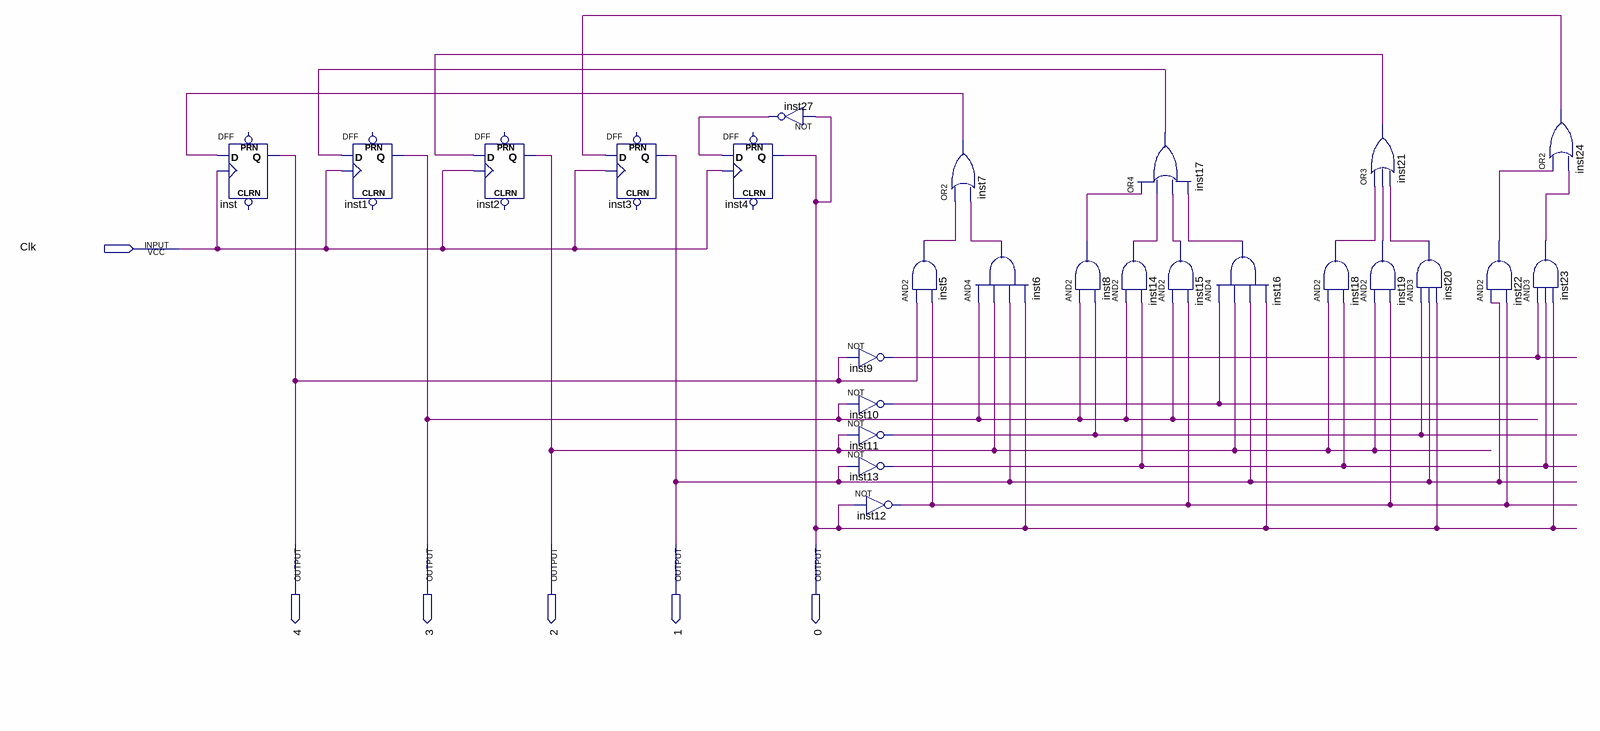
[diagram p0: schematic sheet]
// Quartus schematic Contador17.bdf as structural Verilog: 26 symbols, 6 pins
module Contador17 (
  input  Clk,
  output \4 ,
  output \3 ,
  output \2 ,
  output \1 ,
  output \0 
);

  wire inst5_out, inst6_out, inst7_out, inst8_out, inst9_out, inst10_out, inst11_out, inst12_out, inst13_out,
       inst14_out, inst15_out, inst16_out, inst17_out, inst18_out, inst19_out, inst20_out, inst21_out,
       inst22_out, inst23_out, inst24_out, inst27_out;

  DFF inst (.CLK(Clk), .D(inst7_out), .Q(\4 ));  // open: CLRN, PRN
  DFF inst1 (.CLK(Clk), .D(inst17_out), .Q(\3 ));  // open: CLRN, PRN
  DFF inst2 (.CLK(Clk), .D(inst21_out), .Q(\2 ));  // open: CLRN, PRN
  DFF inst3 (.CLK(Clk), .D(inst24_out), .Q(\1 ));  // open: CLRN, PRN
  DFF inst4 (.CLK(Clk), .D(inst27_out), .Q(\0 ));  // open: CLRN, PRN
  not inst27 (inst27_out, \0 );
  not inst9 (inst9_out, \4 );
  not inst10 (inst10_out, \3 );
  not inst11 (inst11_out, \2 );
  not inst13 (inst13_out, \1 );
  not inst12 (inst12_out, \0 );
  and inst5 (inst5_out, \4 , inst12_out);
  or inst7 (inst7_out, inst5_out, inst6_out);
  and inst6 (inst6_out, \3 , \2 , \1 , \0 );
  and inst8 (inst8_out, \3 , inst11_out);
  and inst14 (inst14_out, \3 , inst13_out);
  or inst17 (inst17_out, inst8_out, inst14_out, inst15_out, inst16_out);
  and inst15 (inst15_out, \3 , inst12_out);
  and inst16 (inst16_out, inst10_out, \2 , \1 , \0 );
  or inst21 (inst21_out, inst18_out, inst19_out, inst20_out);
  and inst18 (inst18_out, \2 , inst13_out);
  and inst19 (inst19_out, \2 , inst12_out);
  and inst20 (inst20_out, inst11_out, \1 , \0 );
  and inst22 (inst22_out, \1 , inst12_out);
  or inst24 (inst24_out, inst22_out, inst23_out);
  and inst23 (inst23_out, inst9_out, inst13_out, \0 );
endmodule
